# Altium project B9_HashBoard.PrjPcb (part 2 of 2)

## Sheet BF24_1.SchDoc
size 300 x 200 mm
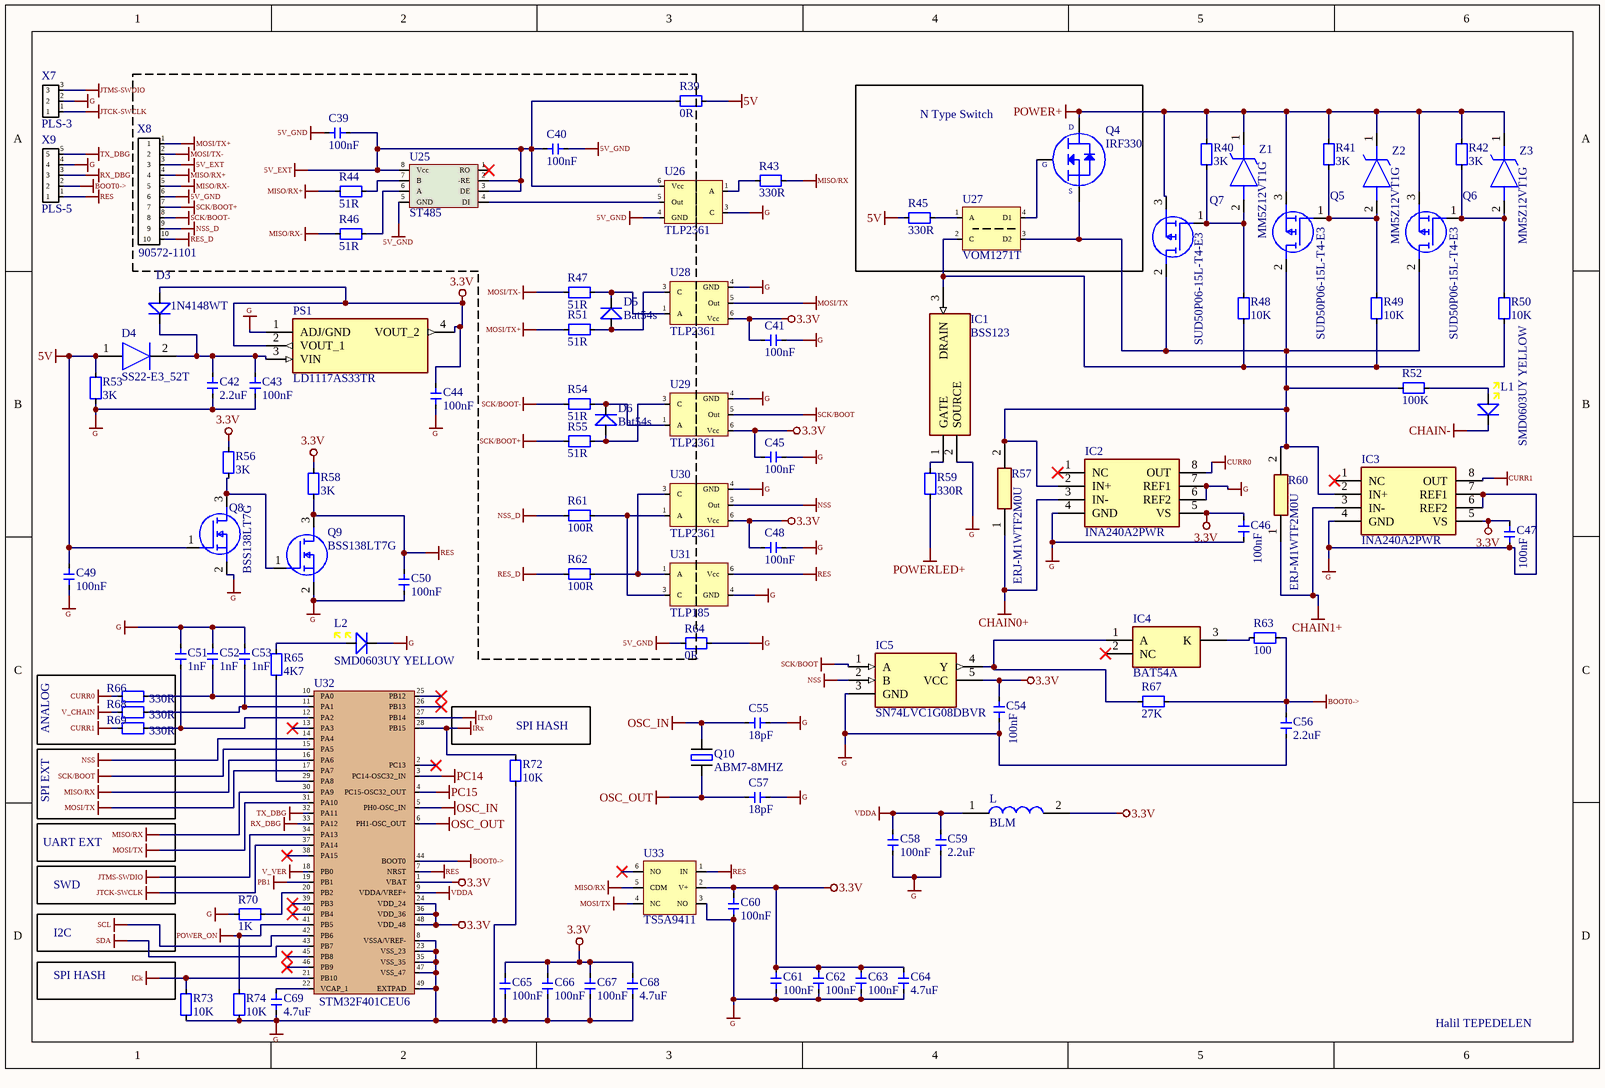
[diagram p7: BF24_1.SchDoc]

### Parts
C39  100nF  [C-0402R]
C40  100nF  [C-0402R]
C41  100nF  [C-0402R]
C42  2.2uF  [C-0402R]
C43  100nF  [C-0402R]
C44  100nF  [C-0402R]
C45  100nF  [C-0402R]
C46  100nF  [C-0402R]
C47  100nF  [C-0402R]
C48  100nF  [C-0402R]
C49  100nF  [C-0402R]
C50  100nF  [C-0402R]
C51  1nF  [C-0603W]
C52  1nF  [C-0603W]
C53  1nF  [C-0603W]
C54  100nF  [C-0402R]
C55  18pF  [C-0402R]
C56  2.2uF  [C-0603W]
C57  18pF  [C-0402R]
C58  100nF  [C-0402R]
C59  2.2uF  [C-0402R]
C60  100nF  [C-0402R]
C61  100nF  [C-0402R]
C62  100nF  [C-0402R]
C63  100nF  [C-0402R]
C64  4.7uF  [C-0603W]
C65  100nF  [C-0402R]
C66  100nF  [C-0402R]
C67  100nF  [C-0402R]
C68  4.7uF  [C-0603W]
C69  4.7uF  [C-0603W]
D3  1N4148WT  [1n4148]
D4  SS22-E3_52T  [ss22]
D5  Bat54s  [bat54s]
D6  Bat54s  [bat54s]
IC1  BSS123  [bss123]
IC2  INA240A2PWR  [ina240]
IC3  INA240A2PWR  [ina240]
IC4  BAT54A  [bat54a]
IC5  SN74LVC1G08DBVR  [sn74lvc]
L  BLM  [R-0603W]
L1  SMD0603UY YELLOW  [R-0603W]
L2  SMD0603UY YELLOW  [R-0603W]
PS1  LD1117AS33TR  [ld1117a]
Q4  IRF330  [DPAK_TO263]
Q5  SUD50P06-15L-T4-E3  [SUD50P0615LT4E3]
Q6  SUD50P06-15L-T4-E3  [SUD50P0615LT4E3]
Q7  SUD50P06-15L-T4-E3  [SUD50P0615LT4E3]
Q8  BSS138LT7G  [bss138]
Q9  BSS138LT7G  [bss138]
Q10  ABM7-8MHZ  [abm-8mhz]
R39  0R  [R-0402R]
R40  3K  [R-0402R]
R41  3K  [R-0402R]
R42  3K  [R-0402R]
R43  330R  [R-0402R]
R44  51R  [R-0603W]
R45  330R  [R-0603W]
R46  51R  [R-0603W]
R47  51R  [R-0603W]
R48  10K  [R-1206W]
R49  10K  [R-1206W]
R50  10K  [R-1206W]
R51  51R  [R-0603W]
R52  100K  [R-0603W]
R53  3K  [R-0402R]
R54  51R  [R-0603W]
R55  51R  [R-0603W]
R56  3K  [R-0402R]
R57  ERJ-M1WTF2M0U  [R-1210R]
R58  3K  [R-0402R]
R59  330R  [R-0603W]
R60  ERJ-M1WTF2M0U  [R-1210R]
R61  100R  [R-0603W]
R62  100R  [R-0603W]
R63  100  [R-0603W]
R64  0R  [R-0402R]
R65  4K7  [R-0603W]
R66  330R  [R-0603W]
R67  27K  [R-0402R]
R68  330R  [R-0603W]
R69  330R  [R-0603W]
R70  1K  [R-0402R]
R72  10K  [R-0402R]
R73  10K  [R-0402R]
R74  10K  [R-0402R]
U25  ST485  [st485]
U26  TLP2361  [tlp2361]
U27  VOM1271T  [vom12]
U28  TLP2361  [tlp2361]
U29  TLP2361  [tlp2361]
U30  TLP2361  [tlp2361]
U31  TLP185  [tlp185]
U32  STM32F401CEU6  [stm32f401ceu6]
U33  TS5A9411  [ts5a9411]
X7  PLS-3  [3pinCon]
X8  90572-1101  [idc20]
X9  PLS-5  [5pinCon]
Z1  MM5Z12VT1G  [mm5z]
Z2  MM5Z12VT1G  [mm5z]
Z3  MM5Z12VT1G  [mm5z]

### Blocks framed on the sheet
N Type Switch: Q4 R45 U27
ANALOG: R66 R68 R69

### Nets
3.3V: C41.1 C44.2 C45.1 C46.2 C47.2 C48.1 C54.2 C60.2 C61.2 C62.2 C63.2 C64.2 C65.2 C66.2 C67.2 C68.2 D3.2 IC2.5(VS) IC3.5(VS) IC5.5(VCC) L.2 PS1.2(VOUT_1) PS1.4(VOUT_2) R56.2 R58.2 U28.6(Vcc) U29.6(Vcc) U30.6(Vcc) U32.1(VBAT) U32.24(VDD_24) U32.36(VDD_36) U32.48(VDD_48) U33.2(V+)
5V: C49.2 D4.1(A) Q8.1(G) R39.2 R45.1 R53.2
5V_EXT: C39.2 C40.1 R39.1 U25.2(-RE) U25.3(DE) U25.8(Vcc) U26.6(Vcc) X8.3
5V_GND: C39.1 C40.2 R64.1 U25.5(GND) U26.4(GND) X8.6
BOOT0->: C56.2 R63.2 R67.2 U32.44(BOOT0) X9.2
CHAIN-: IC2.3(IN-) IC3.3(IN-) L1.2 R57.1 R60.1  [also labelled CHAIN0+, CHAIN1+]
CURR0: IC2.8(OUT) R66.1
CURR1: IC3.8(OUT) R69.1
G: C41.2 C42.1 C43.1 C44.1 C45.2 C46.1 C47.1 C48.2 C49.1 C50.1 C51.2 C52.2 C53.2 C54.1 C55.2 C56.1 C57.2 C58.1 C59.1 C60.1 C61.1 C62.1 C63.1 C64.1 C65.1 C66.1 C67.1 C68.1 C69.1 IC1.2(SOURCE) IC2.4(GND) IC2.6(REF2) IC2.7(REF1) IC3.4(GND) IC3.6(REF2) IC3.7(REF1) IC5.3(GND) L2.2 PS1.1(ADJ/GND) Q8.2(S) Q9.2(S) R53.1 R64.2 R70.1 R72.1 R73.1 R74.1 U26.3(C) U28.4(GND) U29.4(GND) U30.4(GND) U31.4(GND) U32.8(VSSA/VREF-) U32.23(VSS_23) U32.35(VSS_35) U32.47(VSS_47) U32.49(EXTPAD) U33.3(NO) X7.2 X9.4
ICk: R73.2 U32.21(PB10)
IRx: R72.2 U32.28(PB15)
ITx0: U32.27(PB14)
JTCK-SWCLK: U32.37(PA14) X7.1
JTMS-SWDIO: U32.34(PA13) X7.3
MISO/RX: R43.2 U32.16(PA6) U32.30(PA9) U33.5(CDM)
MISO/RX+: R44.1 X8.4
MISO/RX-: R46.1 X8.5
MOSI/TX: U28.5(Out) U32.17(PA7) U32.31(PA10) U33.4(NC)
MOSI/TX+: R51.1 X8.1
MOSI/TX-: R47.1 X8.2
NSS: IC5.2(B) U30.5(Out) U32.14(PA4)
NSS_D: R61.1 X8.9
OSC_IN: C55.1 Q10.1 U32.5(PH0-OSC_IN)
OSC_OUT: C57.1 Q10.2 U32.6(PH1-OSC_OUT)
PB1: U32.19(PB1)
PC14: U32.3(PC14-OSC32_IN)
PC15: U32.4(PC15-OSC32_OUT)
POWER+: Q4.3 Q5.3(S) Q6.3(S) Q7.3(S) R40.2 R41.2 R42.2 Z1.1(K) Z2.1(K) Z3.1(K)
POWER_ON: R74.2 U32.41(PB5)
POWERLED+: R59.1
RES: C50.2 Q9.3(D) R58.1 U31.6(Vcc) U32.7(NRST) U33.1(IN) X9.1
RES_D: R62.1 X8.10
RX_DBG: U32.33(PA12) X9.3
SCK/BOOT: IC5.1(A) U29.5(Out) U32.15(PA5)
SCK/BOOT+: R55.1 X8.7
SCK/BOOT-: R54.1 X8.8
SCL: U32.42(PB6)
SDA: U32.43(PB7)
TX_DBG: U32.32(PA11) X9.5
V_CHAIN: R68.1
V_VER: U32.18(PB0)
VDDA: C58.2 C59.2 L.1 U32.9(VDDA/VREF+)
NetC42_2: C42.2 C43.2 D3.1 D4.2(K) PS1.3(VIN)
NetC51_1: C51.1 R69.2 U32.12(PA2)
NetC52_1: C52.1 R66.2 U32.10(PA0)
NetC53_1: C53.1 R68.2 U32.11(PA1)
NetC69_2: C69.2 U32.22(VCAP_1)
NetD5_1: D5.1 R51.2 U28.3(C)
NetD5_2: D5.2 R47.2 U28.1(A)
NetD6_1: D6.1 R55.2 U29.3(C)
NetD6_2: D6.2 R54.2 U29.1(A)
NetIC1_1: IC1.1(GATE) R59.2
NetIC1_3: IC1.3(DRAIN) R48.1 R49.1 R50.1 U27.2(C)
NetIC2_2: IC2.2(IN+) IC3.2(IN+) Q4.2 Q5.2(D) Q6.2(D) Q7.2(D) R52.1 R57.2 R60.2 U27.3(D2)
NetIC4_1: IC4.1(A) IC5.4(Y) R67.1
NetIC4_3: IC4.3(K) R63.1
NetL1_1: L1.1 R52.2
NetL2_1: L2.1 R65.2
NetQ4_1: Q4.1 U27.4(D1)
NetQ5_1: Q5.1(G) R41.1 R49.2 Z2.2(A)
NetQ6_1: Q6.1(G) R42.1 R50.2 Z3.2(A)
NetQ7_1: Q7.1(G) R40.1 R48.2 Z1.2(A)
NetQ8_3: Q8.3(D) Q9.1(G) R56.1
NetR43_1: R43.1 U26.1(A)
NetR44_2: R44.2 U25.7(B)
NetR45_2: R45.2 U27.1(A)
NetR46_2: R46.2 U25.6(A)
NetR61_2: R61.2 U30.1(A) U31.3(C)
NetR62_2: R62.2 U30.3(C) U31.1(A)
NetR65_1: R65.1 U32.29(PA8)
NetR70_2: R70.2 U32.20(PB2)
NetU25_4: U25.4(DI) U26.5(Out)

Not connected (* = marked no-connect by the designer): IC2 1(NC)*; IC3 1(NC)*; IC4 2(NC)*; U25 1(RO)*; U32 2(PC13)* 13(PA3)* 25(PB12)* 26(PB13)* 38(PA15)* 39(PB3)* 40(PB4)* 45(PB8)* 46(PB9)*; U33 6(NO)*

### Notes on the sheet
- (near R72) SPI HASH
- SPI EXT
- UART EXT
- SWD
- I2C
- SPI HASH
- Halil TEPEDELEN
- (in symbol IRF3330) D; G; S

### Library data of the parts
C39-C41 C43-C50 C54 C58 C60-C63 C65-C67 = 100nF 0402
C42 C59 = 2.2uF 0402
C51-C53 = 1nF 0603
C55 C57 = 18pF 0402
C56 = 2.2uF 0603
C64 C68 C69 = 4.7uF 0603
D4 = SS22-E3_52T: Diode; Manufacturer_Name: Vishay; Manufacturer_Part_Number: SS22-E3/52T; Datasheet Link: https://componentsearchengine.com/Datasheets/2/SS22-E3_52T.pdf; Height: 2.44mm; Arrow Part Number: SS22-E3/52T; Arrow Price/Stock: https://www.arrow.com/en/products/ss22-e352t/vishay; Mouser Part Number: 625-SS22-E3; Mouser Price/Stock: https://www.mouser.com/Search/Refine.aspx?Keyword=625-SS22-E3
IC1 = BSS123: Integrated Circuit; Manufacturer_Name: Nexperia; Datasheet Link: http://docs-emea.rs-online.com/webdocs/1270/0900766b81270fbb.pdf; Height: 1.1mm; Manufacturer_Part_Number: BSS123; Mouser Part Number: N/A; Mouser Price/Stock: https://www.mouser.com/Search/Refine.aspx?Keyword=N%2FA
IC2 IC3 = INA240A2PWR: Integrated Circuit; Manufacturer_Name: Texas Instruments; Datasheet Link: http://www.ti.com/lit/gpn/INA240; Height: 1.2mm; Manufacturer_Part_Number: INA240A2PWR; Arrow Part Number: INA240A2PWR; Arrow Price/Stock: https://www.arrow.com/en/products/ina240a2pwr/texas-instruments; Mouser Part Number: 595-INA240A2PWR; Mouser Price/Stock: https://www.mouser.co.uk/ProductDetail/Texas-Instruments/INA240A2PWR?qs=aVyJF2WnouQyoKZt%2F7Ylhw%3D%3D
IC4 = BAT54A: Integrated Circuit; Manufacturer_Name: STMicroelectronics; Datasheet Link: http://www.st.com/web/en/resource/technical/document/datasheet/CD00001322.pdf; Height: 1.5mm; Manufacturer_Part_Number: BAT54A
IC5 = SN74LVC1G08DBVR: Integrated Circuit; Manufacturer_Name: Texas Instruments; Datasheet Link: http://www.ti.com/lit/ds/symlink/sn74lvc1g08.pdf; Height: 1.45mm; Manufacturer_Part_Number: SN74LVC1G08DBVR; Arrow Part Number: SN74LVC1G08DBVR; Arrow Price/Stock: https://www.arrow.com/en/products/sn74lvc1g08dbvr/texas-instruments; Mouser Part Number: 595-SN74LVC1G08DBVR; Mouser Price/Stock: https://www.mouser.co.uk/ProductDetail/Texas-Instruments/SN74LVC1G08DBVR?qs=8yeEWhuAOtNjtL049wSCoQ%3D%3D
L = blm inductor 0603
PS1 = LD1117AS33TR: Power Supply; Manufacturer_Name: STMicroelectronics; Datasheet Link: https://4donline.ihs.com/images/VipMasterIC/IC/SGST/SGSTS49356/SGSTS49356-1.pdf?hkey=6D3A4C79FDBF58556ACFDE234799DDF0; Height: 1.9mm; Manufacturer_Part_Number: LD1117AS33TR; Arrow Part Number: LD1117AS33TR; Arrow Price/Stock: https://www.arrow.com/en/products/ld1117as33tr/stmicroelectronics; Mouser Part Number: 511-LD1117AS33; Mouser Price/Stock: https://www.mouser.co.uk/ProductDetail/STMicroelectronics/LD1117AS33TR?qs=C3bf%2FVrkE5CoDDd7wyn%252BaQ%3D%3D
Q4 = IRF3330: Manufacturer: Infineon; Manufacturer Part Number: IRF3205STRLPBF; Drain to Source Voltage (Vdss): 55V; Continuous Drain Current (ID): 110A; Rds On Max: 8mR; Input Capacitance: 3.247nF; Max Power Dissipation: 200W; Turn-Off Delay Time: 50ns; Turn-On Delay Time: 14ns; Gate to Source Voltage (Vgs): 20V; Threshold Voltage: 4V; Supplier 1: Digi-Key; RoHS: Yes; Stock 1: 3281; Pricing 1: 1 = 1,84000, 10 = 1,66600, 100 = 1,33840 (USD); Mount: Surface Mount; Case/Package: D2PAK; Number of Pins: 3; Min Operating Temperature: -55°C; Max Operating Temperature: 175°C; Packaging: Cut Tape; Power Dissipation: 200W; Drain to Source Resistance: 8mR; Drain to Source Breakdown Voltage: 55V; Length: 0.42inch; Height: 0.19inch; Width: 0.38inch; REACH SVHC: No SVHC; Lead Free: Lead Free; ComponentLink1URL: https://www.alliedelec.com/m/d/b8827ca43655240244f0cc5c2198e6b1.pdf?src-supplier=Allied+Electronics; ComponentLink1Description: https://www.alliedelec.com/m/d/b8827ca43655240244f0cc5c2198e6b1.pdf?src-supplier=Allied+Electronics; ComponentLink2URL: https://www.infineon.com/dgdl/irf3205spbf.pdf?fileId=5546d462533600a4015355defac9190c&src-supplier=Digi-Key; ComponentLink2Description: https://www.infineon.com/dgdl/irf3205spbf.pdf?fileId=5546d462533600a4015355defac9190c&src-supplier=Digi-Key; ComponentLink3URL: http://www.infineon.com/dgdl/irf3205spbf.pdf?fileId=5546d462533600a4015355defac9190c&src-supplier=Digi-Key; ComponentLink3Description: http://www.infineon.com/dgdl/irf3205spbf.pdf?fileId=5546d462533600a4015355defac9190c&src-supplier=Digi-Key; ComponentLink4URL: http://www.farnell.com/datasheets/1884183.pdf?src-supplier=Element14; ComponentLink4Description: http://www.farnell.com/datasheets/1884183.pdf?src-supplier=Element14; Supplier Part Number 1: IRF3205STRLPBFCT-ND
Q5-Q7 = SUD50P06-15L-T4-E3: MOSFET (P-Channel); Manufacturer_Name: Vishay; Datasheet Link: https://www.mouser.de/datasheet/2/427/sud50p06-15-1764865.pdf; Height: 2.39mm; Manufacturer_Part_Number: SUD50P06-15L-T4-E3; Arrow Part Number: SUD50P06-15L-T4-E3; Arrow Price/Stock: https://www.arrow.com/en/products/sud50p06-15l-t4-e3/vishay; Mouser Part Number: 78-SUD50P06-15L-T4E3; Mouser Price/Stock: https://www.mouser.co.uk/ProductDetail/Vishay-Semiconductors/SUD50P06-15L-T4-E3?qs=G1LhLIAbs1yBu1wo3pIVcA%3D%3D
Q8 Q9 = BSS138LT7G: MOSFET (N-Channel); Manufacturer_Name: ON Semiconductor; Datasheet Link: https://www.mouser.com/datasheet/2/308/BSS138LT1-D-1522521.pdf; Height: 1.11mm; Manufacturer_Part_Number: BSS138LT7G; Arrow Part Number: BSS138LT7G; Arrow Price/Stock: https://www.arrow.com/en/products/bss138lt7g/on-semiconductor; Mouser Part Number: 863-BSS138LT7G; Mouser Price/Stock: https://www.mouser.co.uk/ProductDetail/ON-Semiconductor/BSS138LT7G?qs=l7cgNqFNU1gVGpXKtqpwiw%3D%3D
R39 R64 = 0R 1206
R40-R42 R53 R56 R58 = 3K 0402
R43 = 330R 0402
R44 R46 R47 R51 R54 R55 = 51R 0603_1
R45 R59 R66 R68 R69 = 330R 0603
R48-R50 = 10K 1206
R52 = 100k 0603
R57 R60 = ERJ-M1WTF2M0U: Resistor; Manufacturer_Name: Panasonic; Datasheet Link: https://componentsearchengine.com/Datasheets/1/ERJ-M1WTF2M0U.pdf; Height: 1.1mm; Manufacturer_Part_Number: ERJ-M1WTF2M0U; Arrow Part Number: ERJ-M1WTF2M0U; Arrow Price/Stock: https://www.arrow.com/en/products/erj-m1wtf2m0u/panasonic; Mouser Part Number: 667-ERJ-M1WTF2M0U; Mouser Price/Stock: https://www.mouser.com/Search/Refine.aspx?Keyword=667-ERJ-M1WTF2M0U
R61 R62 = 100R 0603
R63 = 100 0603
R65 = 4K7 0603
R67 = 27K 0402
R70 = 1K 0402
R72-R74 = 10K 0402
Z1-Z3 = MM5Z12VT1G: Zener Diode; Manufacturer_Name: ON Semiconductor; Datasheet Link: http://www.onsemi.com/pub/Collateral/MM5Z2V4T1-D.PDF; Height: 0.7mm; Manufacturer_Part_Number: MM5Z12VT1G; Arrow Part Number: MM5Z12VT1G; Arrow Price/Stock: https://www.arrow.com/en/products/mm5z12vt1g/on-semiconductor; Mouser Part Number: 863-MM5Z12VT1G; Mouser Price/Stock: https://www.mouser.co.uk/ProductDetail/ON-Semiconductor/MM5Z12VT1G?qs=HVbQlW5zcXXd129ZNePICQ%3D%3D

## Sheet BF24.SchDoc
size A4
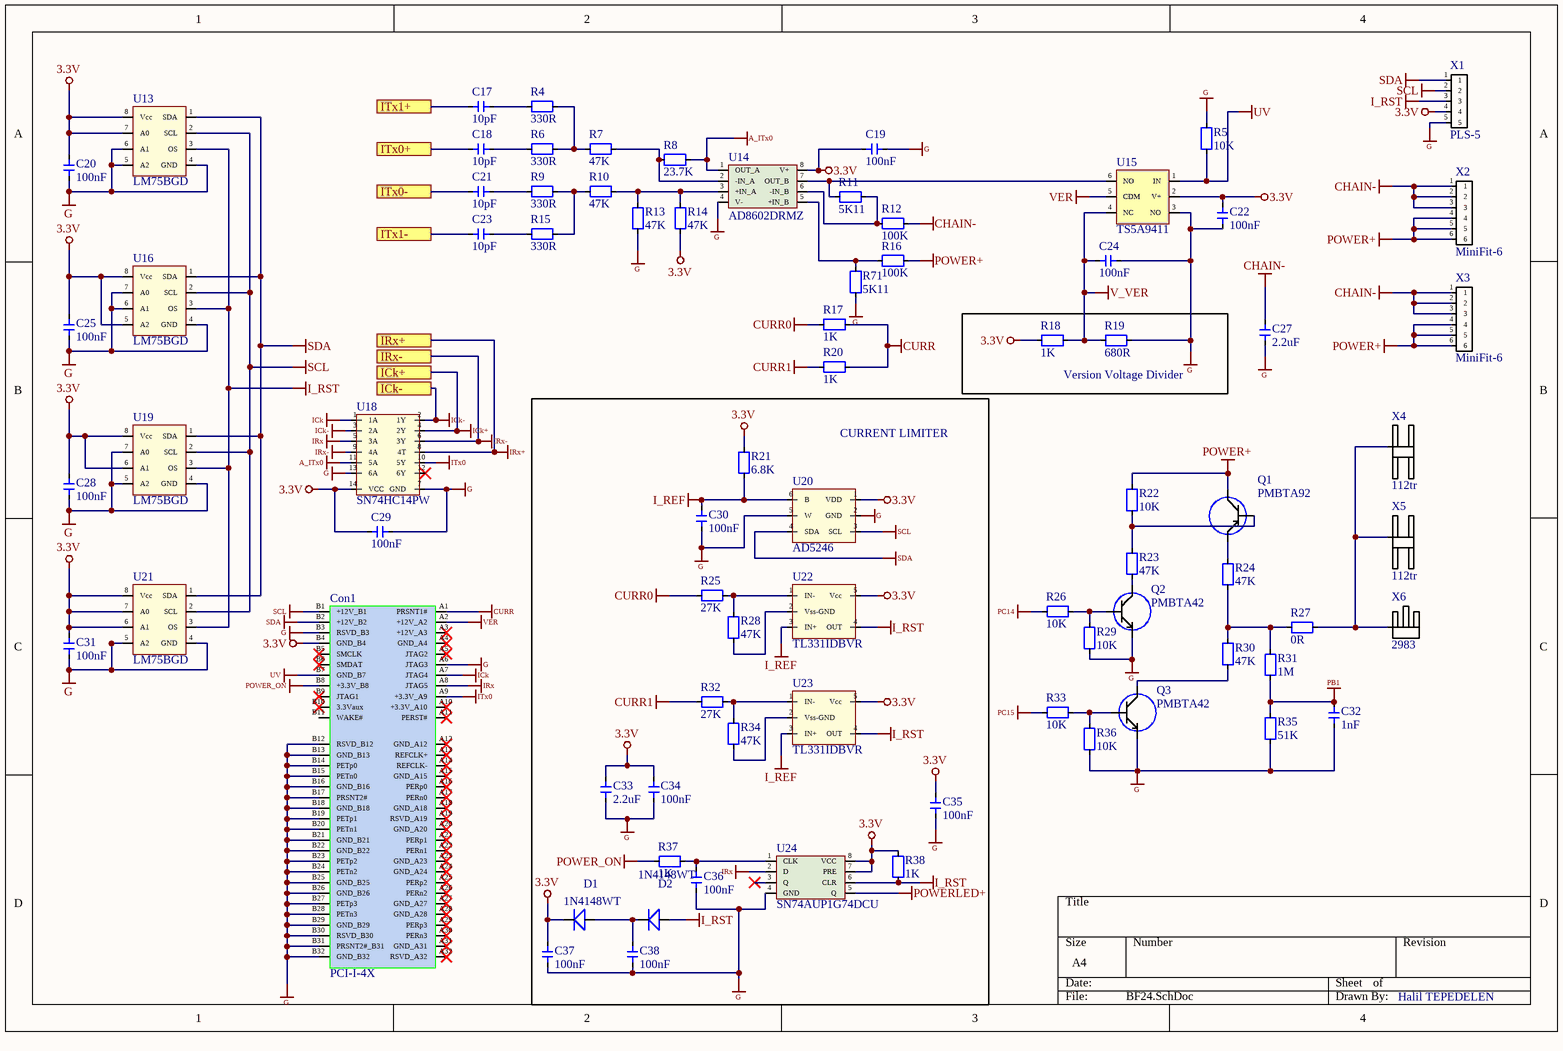
[diagram p8: BF24.SchDoc]

### Parts
C17  10pF  [C-0402R]
C18  10pF  [C-0402R]
C19  100nF  [C-0402R]
C20  100nF  [C-0603W]
C21  10pF  [C-0402R]
C22  100nF  [C-0402R]
C23  10pF  [C-0402R]
C24  100nF  [C-0402R]
C25  100nF  [C-0603W]
C27  2.2uF  [R-1210R]
C28  100nF  [C-0603W]
C29  100nF  [C-0402R]
C30  100nF  [C-0402R]
C31  100nF  [C-0603W]
C32  1nF  [C-0603W]
C33  2.2uF  [C-0402R]
C34  100nF  [C-0402R]
C35  100nF  [C-0402R]
C36  100nF  [C-0402R]
C37  100nF  [C-0402R]
C38  100nF  [C-0402R]
Con1  PCI-I-4X  [SAMTEC_PCIE-064-02-X-D-EMS2]
D1  1N4148WT  [1n4148]
D2  1N4148WT  [1n4148]
Q1  PMBTA92  [pmbta92]
Q2  PMBTA42  [pmbta42]
Q3  PMBTA42  [pmbta42]
R4  330R  [R-0402R]
R5  10K  [R-0402R]
R6  330R  [R-0402R]
R7  47K  [R-0402R]
R8  23.7K  [R-0402R]
R9  330R  [R-0402R]
R10  47K  [R-0402R]
R11  5K11  [R-0603W]
R12  100K  [R-0603W]
R13  47K  [R-0402R]
R14  47K  [R-0402R]
R15  330R  [R-0402R]
R16  100K  [R-0603W]
R17  1K  [R-0402R]
R18  1K  [R-0402R]
R19  680R  [R-0402R]
R20  1K  [R-0402R]
R21  6.8K  [R-0402R]
R22  10K  [R-0603W]
R23  47K  [R-1206W]
R24  47K  [R-1206W]
R25  27K  [R-0402R]
R26  10K  [R-0603W]
R27  0R  [R-0402R]
R28  47K  [R-0402R]
R29  10K  [R-0603W]
R30  47K  [R-1206W]
R31  1M  [R-0402R]
R32  27K  [R-0402R]
R33  10K  [R-0603W]
R34  47K  [R-0402R]
R35  51K  [R-0603W]
R36  10K  [R-0603W]
R37  1K  [R-0402R]
R38  1K  [R-0402R]
R71  5K11  [R-0603W]
U13  LM75BGD  [lm75]
U14  AD8602DRMZ  [ad860]
U15  TS5A9411  [ts5a9411]
U16  LM75BGD  [lm75]
U18  SN74HC14PW  [sn74hcpw]
U19  LM75BGD  [lm75]
U20  AD5246  [ad5246]
U21  LM75BGD  [lm75]
U22  TL331IDBVR  [tl331]
U23  TL331IDBVR  [tl331]
U24  SN74AUP1G74DCU  [sn74aup]
X1  PLS-5  [5pinCon]
X2  MiniFit-6  [MiniFit 6]
X3  MiniFit-6  [MiniFit 6]
X4  112tr  [112tr]
X5  112tr  [112tr]
X6  2983  [2983]

### Blocks framed on the sheet
Version Voltage Divider: R18 R19

### Ports
ICk+, ICk-, IRx+, IRx-, ITx0+, ITx0-, ITx1+, ITx1-

### Nets
3.3V: C19.1 C20.2 C22.2 C25.2 C28.2 C29.1 C31.2 C33.2 C34.2 C35.2 C37.2 Con1.B4(GND_B4) D1.1 R14.1 R18.1 R21.2 R38.2 U13.7(A0) U13.8(Vcc) U14.8(V+) U15.2(V+) U16.5(A2) U16.8(Vcc) U18.14(VCC) U19.6(A1) U19.8(Vcc) U20.1(VDD) U21.6(A1) U21.7(A0) U21.8(Vcc) U22.5(Vcc) U23.5(Vcc) U24.7(PRE) U24.8(VCC) X1.4
A_ITx0: R8.2 U14.1(OUT_A) U18.11(5A)
CHAIN-: C27.2 R12.2 X2.1 X2.2 X2.3 X3.1 X3.2 X3.3
CURR: Con1.A1(PRSNT1#) R17.2 R20.2
CURR0: R17.1 R25.1
CURR1: R20.1 R32.1
G: C19.2 C20.1 C22.1 C24.2 C25.1 C27.1 C28.1 C29.2 C30.1 C31.1 C32.1 C33.1 C34.1 C35.1 C36.1 C37.1 C38.1 Con1.A6(JTAG3) Con1.B3(RSVD_B3) Con1.B12(RSVD_B12) Con1.B13(GND_B13) Con1.B14(PETp0) Con1.B15(PETn0) Con1.B16(GND_B16) Con1.B17(PRSNT2#) Con1.B18(GND_B18) Con1.B19(PETp1) Con1.B20(PETn1) Con1.B21(GND_B21) Con1.B22(GND_B22) Con1.B23(PETp2) Con1.B24(PETn2) Con1.B25(GND_B25) Con1.B26(GND_B26) Con1.B27(PETp3) Con1.B28(PETn3) Con1.B29(GND_B29) Con1.B30(RSVD_B30) Con1.B31(PRSNT2#_B31) Con1.B32(GND_B32) Q2.2 Q3.2 R5.2 R13.1 R19.2 R29.1 R35.1 R36.1 R71.1 U13.4(GND) U13.5(A2) U13.6(A1) U14.4(V-) U15.3(NO) U16.4(GND) U16.6(A1) U16.7(A0) U18.7(GND) U18.13(6A) U19.4(GND) U19.5(A2) U19.7(A0) U20.2(GND) U20.5(W) U21.4(GND) U21.5(A2) U24.4(GND) X1.5
I_REF: C30.2 R21.1 U20.6(B) U22.3(IN+) U23.3(IN+)
I_RST: D2.2 R38.1 U13.3(OS) U16.3(OS) U19.3(OS) U21.3(OS) U22.4(OUT) U23.4(OUT) U24.6(CLR) X1.3
ICk: Con1.A7(JTAG4) U18.1(1A)
ICk+: U18.4(2Y) ; port ICk+
ICk-: U18.2(1Y) U18.3(2A) ; port ICk-
IRx: Con1.A8(JTAG5) U18.5(3A) U24.2(D)
IRx+: U18.8(4T) ; port IRx+
IRx-: U18.6(3Y) U18.9(4A) ; port IRx-
ITx0: Con1.A9(+3.3V_A9) U18.10(5Y)
PB1: C32.2 R31.1 R35.2
PC14: R26.1
PC15: R33.1
POWER+: Q1.2 R16.2 R22.2 X2.4 X2.5 X2.6 X3.4 X3.5 X3.6
POWER_ON: Con1.B8(+3.3V_B8) R37.1
POWERLED+: U24.5(Q)
SCL: Con1.B1(+12V_B1) U13.2(SCL) U16.2(SCL) U19.2(SCL) U20.3(SCL) U21.2(SCL) X1.2
SDA: Con1.B2(+12V_B2) U13.1(SDA) U16.1(SDA) U19.1(SDA) U20.4(SDA) U21.1(SDA) X1.1
UV: Con1.B7(GND_B7) R5.1 U15.1(IN)
V_VER: C24.1 R18.2 R19.1 U15.4(NC)
VER: Con1.A2(+12V_A2) U15.5(CDM)
NetC1_U1_1: C17.1 ; port ITx1+
NetC2_U1_1: C23.1 ; port ITx1-
NetC17_2: C17.2 R4.1
NetC18_1: C18.1 ; port ITx0+
NetC18_2: C18.2 R6.1
NetC21_1: C21.1 ; port ITx0-
NetC21_2: C21.2 R9.1
NetC23_2: C23.2 R15.1
NetC36_2: C36.2 R37.2 U24.1(CLK)
NetC38_2: C38.2 D1.2 D2.1
NetQ1_1: Q1.1 R22.1 R23.2
NetQ1_3: Q1.3 R24.2
NetQ2_1: Q2.1 R26.2 R29.2
NetQ2_3: Q2.3 R23.1
NetQ3_1: Q3.1 R33.2 R36.2
NetQ3_3: Q3.3 R30.1
NetR4_2: R4.2 R6.2 R7.1
NetR7_2: R7.2 R8.1 U14.2(-IN_A)
NetR9_2: R9.2 R10.1 R15.2
NetR10_2: R10.2 R13.2 R14.2 U14.3(+IN_A)
NetR11_1: R11.1 U14.7(OUT_B) U15.6(NO)
NetR11_2: R11.2 R12.1 U14.6(-IN_B)
NetR16_1: R16.1 R71.2 U14.5(+IN_B)
NetR24_1: R24.1 R27.1 R30.2 R31.2
NetR25_2: R25.2 R28.2 U22.1(IN-)
NetR27_2: R27.2 X4.1 X5.1 X6.1
NetR28_1: R28.1 U22.2(Vss-GND)
NetR32_2: R32.2 R34.2 U23.1(IN-)
NetR34_1: R34.1 U23.2(Vss-GND)

Not connected (* = marked no-connect by the designer): Con1 A3(+12V_A3)* A4(GND_A4)* A5(JTAG2)* A10(+3.3V_A10)* A11(PERST#)* A12(GND_A12)* A13(REFCLK+)* A14(REFCLK-)* A15(GND_A15)* A16(PERp0)* A17(PERn0)* A18(GND_A18)* A19(RSVD_A19)* A20(GND_A20)* A21(PERp1)* A22(PERn1)* A23(GND_A23)* A24(GND_A24)* A25(PERp2)* A26(PERn2)* A27(GND_A27)* A28(GND_A28)* A29(PERp3)* A30(PERn3)* A31(GND_A31)* A32(RSVD_A32)* B5(SMCLK)* B6(SMDAT)* B9(JTAG1)* B10(3.3Vaux)* B11(WAKE#); U18 12(6Y)*; U24 3(Q)*

### Notes on the sheet
- CURRENT LIMITER
- Halil TEPEDELEN

### Library data of the parts
C17 C18 C21 C23 = 10pF 0402
C19 C22 C24 C29 C30 C34-C38 = 100nF 0402
C20 C25 C28 C31 = 100nF 0603
C27 = 2.2uF 1210
C32 = 1nF 0603
C33 = 2.2uF 0402
R4 R6 R9 R15 = 330R 0402
R5 = 10K 0402
R7 R10 R13 R14 R28 R34 = 47K 0402
R8 = 23.7K 0402
R11 R71 = 5K11 0603
R12 R16 = 100k 0603
R17 R18 R20 R37 R38 = 1K 0402
R19 = 680R 0402
R21 = 6.8K 0402
R22 R26 R29 R33 R36 = 10K 0603
R23 R24 R30 = 47K 1206
R25 R32 = 27K 0402
R27 = 0R 1206
R31 = 1M 1206
R35 = 51K 0603

## Nets that join several sheets
1: U15 (U3_U15.46), U16 (C8_U16.1), U17 (C12_U17.1)
2: U14 (U3_U14.46), U15 (C8_U15.1), U16 (C12_U16.1)
3: U15 (U3_U15.47), U16 (C7_U16.1), U17 (C9_U17.1)
3.3V: BF24_1 (33 pins), BF24 (35 pins)
4: U14 (U3_U14.47), U15 (C7_U15.1), U16 (C9_U16.1)
5: U14 (C4_U14.1), U15 (C2_U15.1), U16 (U3_U16.54)
6: U15 (C4_U15.1), U16 (C2_U16.1), U17 (U3_U17.54)
7: U14 (C3_U14.1), U15 (C1_U15.1), U16 (U3_U16.55)
8: U15 (C3_U15.1), U16 (C4_U16.1), U17 (C2_U17.1), U18 (U3_U18.54)
9: U15 (U3_U15.48), U16 (C6_U16.1), U17 (C14_U17.1)
10: U14 (U3_U14.48), U15 (C6_U15.1), U16 (C14_U16.1)
11: U15 (U3_U15.49), U16 (C5_U16.1), U17 (C13_U17.1)
12: U14 (U3_U14.49), U15 (C5_U15.1), U16 (C13_U16.1)
CHAIN-: Chain (R2.1 R3.1), U1 (13 pins), U2 (13 pins), U3 (13 pins), U4 (13 pins), U5 (13 pins), U6 (13 pins), U7 (13 pins), U8 (13 pins), U9 (13 pins), U10 (13 pins), U11 (13 pins), U12 (13 pins), U13 (13 pins), U14 (13 pins), U15 (13 pins), U16 (13 pins), U17 (13 pins), U18 (13 pins), U19 (13 pins), U20 (13 pins), U21 (13 pins), U22 (13 pins), U23 (13 pins), U24 (13 pins), U25 (13 pins), U26 (13 pins), U27 (13 pins), U28 (13 pins), BF24_1 (5 pins), BF24 (8 pins)
CURR0: BF24_1 (IC2.8 R66.1), BF24 (R17.1 R25.1)
CURR1: BF24_1 (IC3.8 R69.1), BF24 (R20.1 R32.1)
G: BF24_1 (60 pins), BF24 (68 pins)
GPIO0: U1 (U3_U1.43), U2 (U3_U2.43), U3 (U3_U3.43), U4 (U3_U4.43), U5 (U3_U5.43), U6 (U3_U6.43), U7 (U3_U7.43), U8 (U3_U8.43), U9 (U3_U9.43), U10 (U3_U10.43), U11 (U3_U11.43), U12 (U3_U12.43), U13 (U3_U13.43), U14 (U3_U14.43), U15 (U3_U15.43), U16 (U3_U16.43), U17 (U3_U17.43), U18 (U3_U18.43), U19 (U3_U19.43), U20 (U3_U20.43), U21 (U3_U21.43), U22 (U3_U22.43), U23 (U3_U23.43), U24 (U3_U24.43), U25 (U3_U25.43), U26 (U3_U26.43), U27 (U3_U27.43), U28 (U3_U28.43)
GPIO1: U1 (U3_U1.39), U2 (U3_U2.39), U3 (U3_U3.39), U4 (U3_U4.39), U5 (U3_U5.39), U6 (U3_U6.39), U7 (U3_U7.39), U8 (U3_U8.39), U9 (U3_U9.39), U10 (U3_U10.39), U11 (U3_U11.39), U12 (U3_U12.39), U13 (U3_U13.39), U14 (U3_U14.39), U15 (U3_U15.39), U16 (U3_U16.39), U17 (U3_U17.39), U18 (U3_U18.39), U19 (U3_U19.39), U20 (U3_U20.39), U21 (U3_U21.39), U22 (U3_U22.39), U23 (U3_U23.39), U24 (U3_U24.39), U25 (U3_U25.39), U26 (U3_U26.39), U27 (U3_U27.39), U28 (U3_U28.39)
ICk: BF24_1 (R73.2 U32.21), BF24 (Con1.A7 U18.1)
ICk+: U1 (C6_U1.1), U2 (C14_U2.1), BF24 (U18.4)
ICk-: U1 (C5_U1.1), U2 (C13_U2.1), BF24 (U18.2 U18.3)
IRx: BF24_1 (R72.2 U32.28), BF24 (Con1.A8 U18.5 U24.2)
IRx+: U1 (C8_U1.1), U2 (C12_U2.1), BF24 (U18.8)
IRx-: U1 (C7_U1.1), U2 (C9_U2.1), BF24 (U18.6 U18.9)
ITx0: BF24_1 (U32.27), BF24 (Con1.A9 U18.10)
PB1: BF24_1 (U32.19), BF24 (C32.2 R31.1 R35.2)
PC14: BF24_1 (U32.3), BF24 (R26.1)
PC15: BF24_1 (U32.4), BF24 (R33.1)
POWER+: BF24_1 (10 pins), BF24 (9 pins)
POWER_ON: BF24_1 (R74.2 U32.41), BF24 (Con1.B8 R37.1)
POWERLED+: BF24_1 (R59.1), BF24 (U24.5)
SCL: BF24_1 (U32.42), BF24 (7 pins)
SDA: BF24_1 (U32.43), BF24 (7 pins)
V_VER: BF24_1 (U32.18), BF24 (C24.1 R18.2 R19.1 U15.4)
NetC1_U1_1: U1 (C1_U1.1), U2 (U3_U2.55), BF24 (C17.1)
NetC1_U2_1: U1 (C3_U1.1), U2 (C1_U2.1), U3 (U3_U3.55)
NetC1_U3_1: U2 (C3_U2.1), U3 (C1_U3.1), U4 (U3_U4.55)
NetC1_U4_1: U3 (C3_U3.1), U4 (C1_U4.1), U5 (U3_U5.55)
NetC1_U5_1: U4 (C3_U4.1), U5 (C1_U5.1), U6 (U3_U6.55)
NetC1_U6_1: U5 (C3_U5.1), U6 (C1_U6.1), U7 (U3_U7.55)
NetC1_U7_1: U6 (C3_U6.1), U7 (C1_U7.1), U8 (U3_U8.55)
NetC1_U8_1: U7 (C3_U7.1), U8 (C1_U8.1), U9 (U3_U9.55)
NetC1_U9_1: U8 (C3_U8.1), U9 (C1_U9.1), U10 (U3_U10.55)
NetC1_U10_1: U9 (C3_U9.1), U10 (C1_U10.1), U11 (U3_U11.55)
NetC1_U11_1: U10 (C3_U10.1), U11 (C1_U11.1), U12 (U3_U12.55)
NetC1_U12_1: U11 (C3_U11.1), U12 (C1_U12.1), U13 (U3_U13.55)
NetC1_U13_1: U12 (C3_U12.1), U13 (C1_U13.1), U14 (U3_U14.55)
NetC1_U14_1: U13 (C3_U13.1), U14 (C1_U14.1), U15 (U3_U15.55)
NetC1_U16_1: U16 (C1_U16.1), U17 (U3_U17.55)
NetC1_U17_1: U16 (C3_U16.1), U17 (C1_U17.1), U18 (U3_U18.55)
NetC1_U18_1: U17 (C3_U17.1), U18 (C1_U18.1), U19 (U3_U19.55)
NetC1_U19_1: U18 (C3_U18.1), U19 (C1_U19.1), U20 (U3_U20.55)
NetC1_U20_1: U19 (C3_U19.1), U20 (C1_U20.1), U21 (U3_U21.55)
NetC1_U21_1: U20 (C3_U20.1), U21 (C1_U21.1), U22 (U3_U22.55)
NetC1_U22_1: U21 (C3_U21.1), U22 (C1_U22.1), U23 (U3_U23.55)
NetC1_U23_1: U22 (C3_U22.1), U23 (C1_U23.1), U24 (U3_U24.55)
NetC1_U24_1: U23 (C3_U23.1), U24 (C1_U24.1), U25 (U3_U25.55)
NetC1_U25_1: U24 (C3_U24.1), U25 (C1_U25.1), U26 (U3_U26.55)
NetC1_U26_1: U25 (C3_U25.1), U26 (C1_U26.1), U27 (U3_U27.55)
NetC1_U27_1: U26 (C3_U26.1), U27 (C1_U27.1), U28 (U3_U28.55)
NetC1_U28_1: U27 (C3_U27.1), U28 (C1_U28.1)
NetC2_U1_1: U1 (C2_U1.1), U2 (U3_U2.54), BF24 (C23.1)
NetC2_U2_1: U1 (C4_U1.1), U2 (C2_U2.1), U3 (U3_U3.54)
NetC2_U3_1: U2 (C4_U2.1), U3 (C2_U3.1), U4 (U3_U4.54)
NetC2_U4_1: U3 (C4_U3.1), U4 (C2_U4.1), U5 (U3_U5.54)
NetC2_U5_1: U4 (C4_U4.1), U5 (C2_U5.1), U6 (U3_U6.54)
NetC2_U6_1: U5 (C4_U5.1), U6 (C2_U6.1), U7 (U3_U7.54)
NetC2_U7_1: U6 (C4_U6.1), U7 (C2_U7.1), U8 (U3_U8.54)
NetC2_U8_1: U7 (C4_U7.1), U8 (C2_U8.1), U9 (U3_U9.54)
NetC2_U9_1: U8 (C4_U8.1), U9 (C2_U9.1), U10 (U3_U10.54)
NetC2_U10_1: U9 (C4_U9.1), U10 (C2_U10.1), U11 (U3_U11.54)
NetC2_U11_1: U10 (C4_U10.1), U11 (C2_U11.1), U12 (U3_U12.54)
NetC2_U12_1: U11 (C4_U11.1), U12 (C2_U12.1), U13 (U3_U13.54)
NetC2_U13_1: U12 (C4_U12.1), U13 (C2_U13.1), U14 (U3_U14.54)
NetC2_U14_1: U13 (C4_U13.1), U14 (C2_U14.1), U15 (U3_U15.54)
NetC2_U18_1: U17 (C4_U17.1), U18 (C2_U18.1), U19 (U3_U19.54)
NetC2_U19_1: U18 (C4_U18.1), U19 (C2_U19.1), U20 (U3_U20.54)
NetC2_U20_1: U19 (C4_U19.1), U20 (C2_U20.1), U21 (U3_U21.54)
NetC2_U21_1: U20 (C4_U20.1), U21 (C2_U21.1), U22 (U3_U22.54)
NetC2_U22_1: U21 (C4_U21.1), U22 (C2_U22.1), U23 (U3_U23.54)
NetC2_U23_1: U22 (C4_U22.1), U23 (C2_U23.1), U24 (U3_U24.54)
NetC2_U24_1: U23 (C4_U23.1), U24 (C2_U24.1), U25 (U3_U25.54)
NetC2_U25_1: U24 (C4_U24.1), U25 (C2_U25.1), U26 (U3_U26.54)
NetC2_U26_1: U25 (C4_U25.1), U26 (C2_U26.1), U27 (U3_U27.54)
NetC2_U27_1: U26 (C4_U26.1), U27 (C2_U27.1), U28 (U3_U28.54)
NetC2_U28_1: U27 (C4_U27.1), U28 (C2_U28.1)
NetC5_U2_1: U1 (U3_U1.49), U2 (C5_U2.1), U3 (C13_U3.1)
NetC5_U3_1: U2 (U3_U2.49), U3 (C5_U3.1), U4 (C13_U4.1)
NetC5_U4_1: U3 (U3_U3.49), U4 (C5_U4.1), U5 (C13_U5.1)
NetC5_U5_1: U4 (U3_U4.49), U5 (C5_U5.1), U6 (C13_U6.1)
NetC5_U6_1: U5 (U3_U5.49), U6 (C5_U6.1), U7 (C13_U7.1)
NetC5_U7_1: U6 (U3_U6.49), U7 (C5_U7.1), U8 (C13_U8.1)
NetC5_U8_1: U7 (U3_U7.49), U8 (C5_U8.1), U9 (C13_U9.1)
NetC5_U9_1: U8 (U3_U8.49), U9 (C5_U9.1), U10 (C13_U10.1)
NetC5_U10_1: U9 (U3_U9.49), U10 (C5_U10.1), U11 (C13_U11.1)
NetC5_U11_1: U10 (U3_U10.49), U11 (C5_U11.1), U12 (C13_U12.1)
NetC5_U12_1: U11 (U3_U11.49), U12 (C5_U12.1), U13 (C13_U13.1)
NetC5_U13_1: U12 (U3_U12.49), U13 (C5_U13.1), U14 (C13_U14.1)
NetC5_U14_1: U13 (U3_U13.49), U14 (C5_U14.1), U15 (C13_U15.1)
NetC5_U17_1: U16 (U3_U16.49), U17 (C5_U17.1), U18 (C13_U18.1)
NetC5_U18_1: U17 (U3_U17.49), U18 (C5_U18.1), U19 (C13_U19.1)
NetC5_U19_1: U18 (U3_U18.49), U19 (C5_U19.1), U20 (C13_U20.1)
NetC5_U20_1: U19 (U3_U19.49), U20 (C5_U20.1), U21 (C13_U21.1)
NetC5_U21_1: U20 (U3_U20.49), U21 (C5_U21.1), U22 (C13_U22.1)
NetC5_U22_1: U21 (U3_U21.49), U22 (C5_U22.1), U23 (C13_U23.1)
NetC5_U23_1: U22 (U3_U22.49), U23 (C5_U23.1), U24 (C13_U24.1)
NetC5_U24_1: U23 (U3_U23.49), U24 (C5_U24.1), U25 (C13_U25.1)
NetC5_U25_1: U24 (U3_U24.49), U25 (C5_U25.1), U26 (C13_U26.1)
NetC5_U26_1: U25 (U3_U25.49), U26 (C5_U26.1), U27 (C13_U27.1)
NetC5_U27_1: U26 (U3_U26.49), U27 (C5_U27.1), U28 (C13_U28.1)
NetC5_U28_1: U27 (U3_U27.49), U28 (C5_U28.1)
NetC6_U2_1: U1 (U3_U1.48), U2 (C6_U2.1), U3 (C14_U3.1)
NetC6_U3_1: U2 (U3_U2.48), U3 (C6_U3.1), U4 (C14_U4.1)
NetC6_U4_1: U3 (U3_U3.48), U4 (C6_U4.1), U5 (C14_U5.1)
NetC6_U5_1: U4 (U3_U4.48), U5 (C6_U5.1), U6 (C14_U6.1)
NetC6_U6_1: U5 (U3_U5.48), U6 (C6_U6.1), U7 (C14_U7.1)
NetC6_U7_1: U6 (U3_U6.48), U7 (C6_U7.1), U8 (C14_U8.1)
NetC6_U8_1: U7 (U3_U7.48), U8 (C6_U8.1), U9 (C14_U9.1)
NetC6_U9_1: U8 (U3_U8.48), U9 (C6_U9.1), U10 (C14_U10.1)
NetC6_U10_1: U9 (U3_U9.48), U10 (C6_U10.1), U11 (C14_U11.1)
NetC6_U11_1: U10 (U3_U10.48), U11 (C6_U11.1), U12 (C14_U12.1)
NetC6_U12_1: U11 (U3_U11.48), U12 (C6_U12.1), U13 (C14_U13.1)
NetC6_U13_1: U12 (U3_U12.48), U13 (C6_U13.1), U14 (C14_U14.1)
NetC6_U14_1: U13 (U3_U13.48), U14 (C6_U14.1), U15 (C14_U15.1)
NetC6_U17_1: U16 (U3_U16.48), U17 (C6_U17.1), U18 (C14_U18.1)
NetC6_U18_1: U17 (U3_U17.48), U18 (C6_U18.1), U19 (C14_U19.1)
NetC6_U19_1: U18 (U3_U18.48), U19 (C6_U19.1), U20 (C14_U20.1)
NetC6_U20_1: U19 (U3_U19.48), U20 (C6_U20.1), U21 (C14_U21.1)
NetC6_U21_1: U20 (U3_U20.48), U21 (C6_U21.1), U22 (C14_U22.1)
NetC6_U22_1: U21 (U3_U21.48), U22 (C6_U22.1), U23 (C14_U23.1)
NetC6_U23_1: U22 (U3_U22.48), U23 (C6_U23.1), U24 (C14_U24.1)
NetC6_U24_1: U23 (U3_U23.48), U24 (C6_U24.1), U25 (C14_U25.1)
NetC6_U25_1: U24 (U3_U24.48), U25 (C6_U25.1), U26 (C14_U26.1)
NetC6_U26_1: U25 (U3_U25.48), U26 (C6_U26.1), U27 (C14_U27.1)
NetC6_U27_1: U26 (U3_U26.48), U27 (C6_U27.1), U28 (C14_U28.1)
NetC6_U28_1: U27 (U3_U27.48), U28 (C6_U28.1)
NetC7_U2_1: U1 (U3_U1.47), U2 (C7_U2.1), U3 (C9_U3.1)
NetC7_U3_1: U2 (U3_U2.47), U3 (C7_U3.1), U4 (C9_U4.1)
NetC7_U4_1: U3 (U3_U3.47), U4 (C7_U4.1), U5 (C9_U5.1)
NetC7_U5_1: U4 (U3_U4.47), U5 (C7_U5.1), U6 (C9_U6.1)
NetC7_U6_1: U5 (U3_U5.47), U6 (C7_U6.1), U7 (C9_U7.1)
NetC7_U7_1: U6 (U3_U6.47), U7 (C7_U7.1), U8 (C9_U8.1)
NetC7_U8_1: U7 (U3_U7.47), U8 (C7_U8.1), U9 (C9_U9.1)
NetC7_U9_1: U8 (U3_U8.47), U9 (C7_U9.1), U10 (C9_U10.1)
NetC7_U10_1: U9 (U3_U9.47), U10 (C7_U10.1), U11 (C9_U11.1)
NetC7_U11_1: U10 (U3_U10.47), U11 (C7_U11.1), U12 (C9_U12.1)
NetC7_U12_1: U11 (U3_U11.47), U12 (C7_U12.1), U13 (C9_U13.1)
NetC7_U13_1: U12 (U3_U12.47), U13 (C7_U13.1), U14 (C9_U14.1)
NetC7_U14_1: U13 (U3_U13.47), U14 (C7_U14.1), U15 (C9_U15.1)
NetC7_U17_1: U16 (U3_U16.47), U17 (C7_U17.1), U18 (C9_U18.1)
NetC7_U18_1: U17 (U3_U17.47), U18 (C7_U18.1), U19 (C9_U19.1)
NetC7_U19_1: U18 (U3_U18.47), U19 (C7_U19.1), U20 (C9_U20.1)
NetC7_U20_1: U19 (U3_U19.47), U20 (C7_U20.1), U21 (C9_U21.1)
NetC7_U21_1: U20 (U3_U20.47), U21 (C7_U21.1), U22 (C9_U22.1)
NetC7_U22_1: U21 (U3_U21.47), U22 (C7_U22.1), U23 (C9_U23.1)
NetC7_U23_1: U22 (U3_U22.47), U23 (C7_U23.1), U24 (C9_U24.1)
NetC7_U24_1: U23 (U3_U23.47), U24 (C7_U24.1), U25 (C9_U25.1)
NetC7_U25_1: U24 (U3_U24.47), U25 (C7_U25.1), U26 (C9_U26.1)
NetC7_U26_1: U25 (U3_U25.47), U26 (C7_U26.1), U27 (C9_U27.1)
NetC7_U27_1: U26 (U3_U26.47), U27 (C7_U27.1), U28 (C9_U28.1)
NetC7_U28_1: U27 (U3_U27.47), U28 (C7_U28.1)
NetC8_U2_1: U1 (U3_U1.46), U2 (C8_U2.1), U3 (C12_U3.1)
NetC8_U3_1: U2 (U3_U2.46), U3 (C8_U3.1), U4 (C12_U4.1)
NetC8_U4_1: U3 (U3_U3.46), U4 (C8_U4.1), U5 (C12_U5.1)
NetC8_U5_1: U4 (U3_U4.46), U5 (C8_U5.1), U6 (C12_U6.1)
NetC8_U6_1: U5 (U3_U5.46), U6 (C8_U6.1), U7 (C12_U7.1)
NetC8_U7_1: U6 (U3_U6.46), U7 (C8_U7.1), U8 (C12_U8.1)
NetC8_U8_1: U7 (U3_U7.46), U8 (C8_U8.1), U9 (C12_U9.1)
NetC8_U9_1: U8 (U3_U8.46), U9 (C8_U9.1), U10 (C12_U10.1)
NetC8_U10_1: U9 (U3_U9.46), U10 (C8_U10.1), U11 (C12_U11.1)
NetC8_U11_1: U10 (U3_U10.46), U11 (C8_U11.1), U12 (C12_U12.1)
NetC8_U12_1: U11 (U3_U11.46), U12 (C8_U12.1), U13 (C12_U13.1)
NetC8_U13_1: U12 (U3_U12.46), U13 (C8_U13.1), U14 (C12_U14.1)
NetC8_U14_1: U13 (U3_U13.46), U14 (C8_U14.1), U15 (C12_U15.1)
NetC8_U17_1: U16 (U3_U16.46), U17 (C8_U17.1), U18 (C12_U18.1)
NetC8_U18_1: U17 (U3_U17.46), U18 (C8_U18.1), U19 (C12_U19.1)
NetC8_U19_1: U18 (U3_U18.46), U19 (C8_U19.1), U20 (C12_U20.1)
NetC8_U20_1: U19 (U3_U19.46), U20 (C8_U20.1), U21 (C12_U21.1)
NetC8_U21_1: U20 (U3_U20.46), U21 (C8_U21.1), U22 (C12_U22.1)
NetC8_U22_1: U21 (U3_U21.46), U22 (C8_U22.1), U23 (C12_U23.1)
NetC8_U23_1: U22 (U3_U22.46), U23 (C8_U23.1), U24 (C12_U24.1)
NetC8_U24_1: U23 (U3_U23.46), U24 (C8_U24.1), U25 (C12_U25.1)
NetC8_U25_1: U24 (U3_U24.46), U25 (C8_U25.1), U26 (C12_U26.1)
NetC8_U26_1: U25 (U3_U25.46), U26 (C8_U26.1), U27 (C12_U27.1)
NetC8_U27_1: U26 (U3_U26.46), U27 (C8_U27.1), U28 (C12_U28.1)
NetC8_U28_1: U27 (U3_U27.46), U28 (C8_U28.1)
NetC18_1: U1 (U3_U1.55), BF24 (C18.1)
NetC21_1: U1 (U3_U1.54), BF24 (C21.1)
NetR2_2: Chain (R2.2), U28 (U3_U28.49)
NetR3_2: Chain (R3.2), U28 (U3_U28.48)